# Altium project Coral_Dev_Baseboard.PrjPcb (part 2 of 5)

## Sheet 04_HDMI_MIPI.SchDoc
size A2; ApprovedBy: DNP; CheckedBy: DNP; Author: DNP; CompanyName: Google LLC; DrawnBy: DNP; Engineer: Bangfei/Michael/Leo; Organization: Google LLC; Address1: 1600 Amphitheatre Parkway; Address2: Mountain View, CA 94043; Address3: DNP; Address4: DNP; DocumentNumber: DNP; Revision: PVT; SheetNumber: 4; SheetTotal: 11; VersionControl_RevNumber: DNP; IsUserConfigurable: DNP; Time: DNP; ImagePath: DNP; Rule: DNP; ProjectName: Enterprise; Application_BuildNumber: DNP
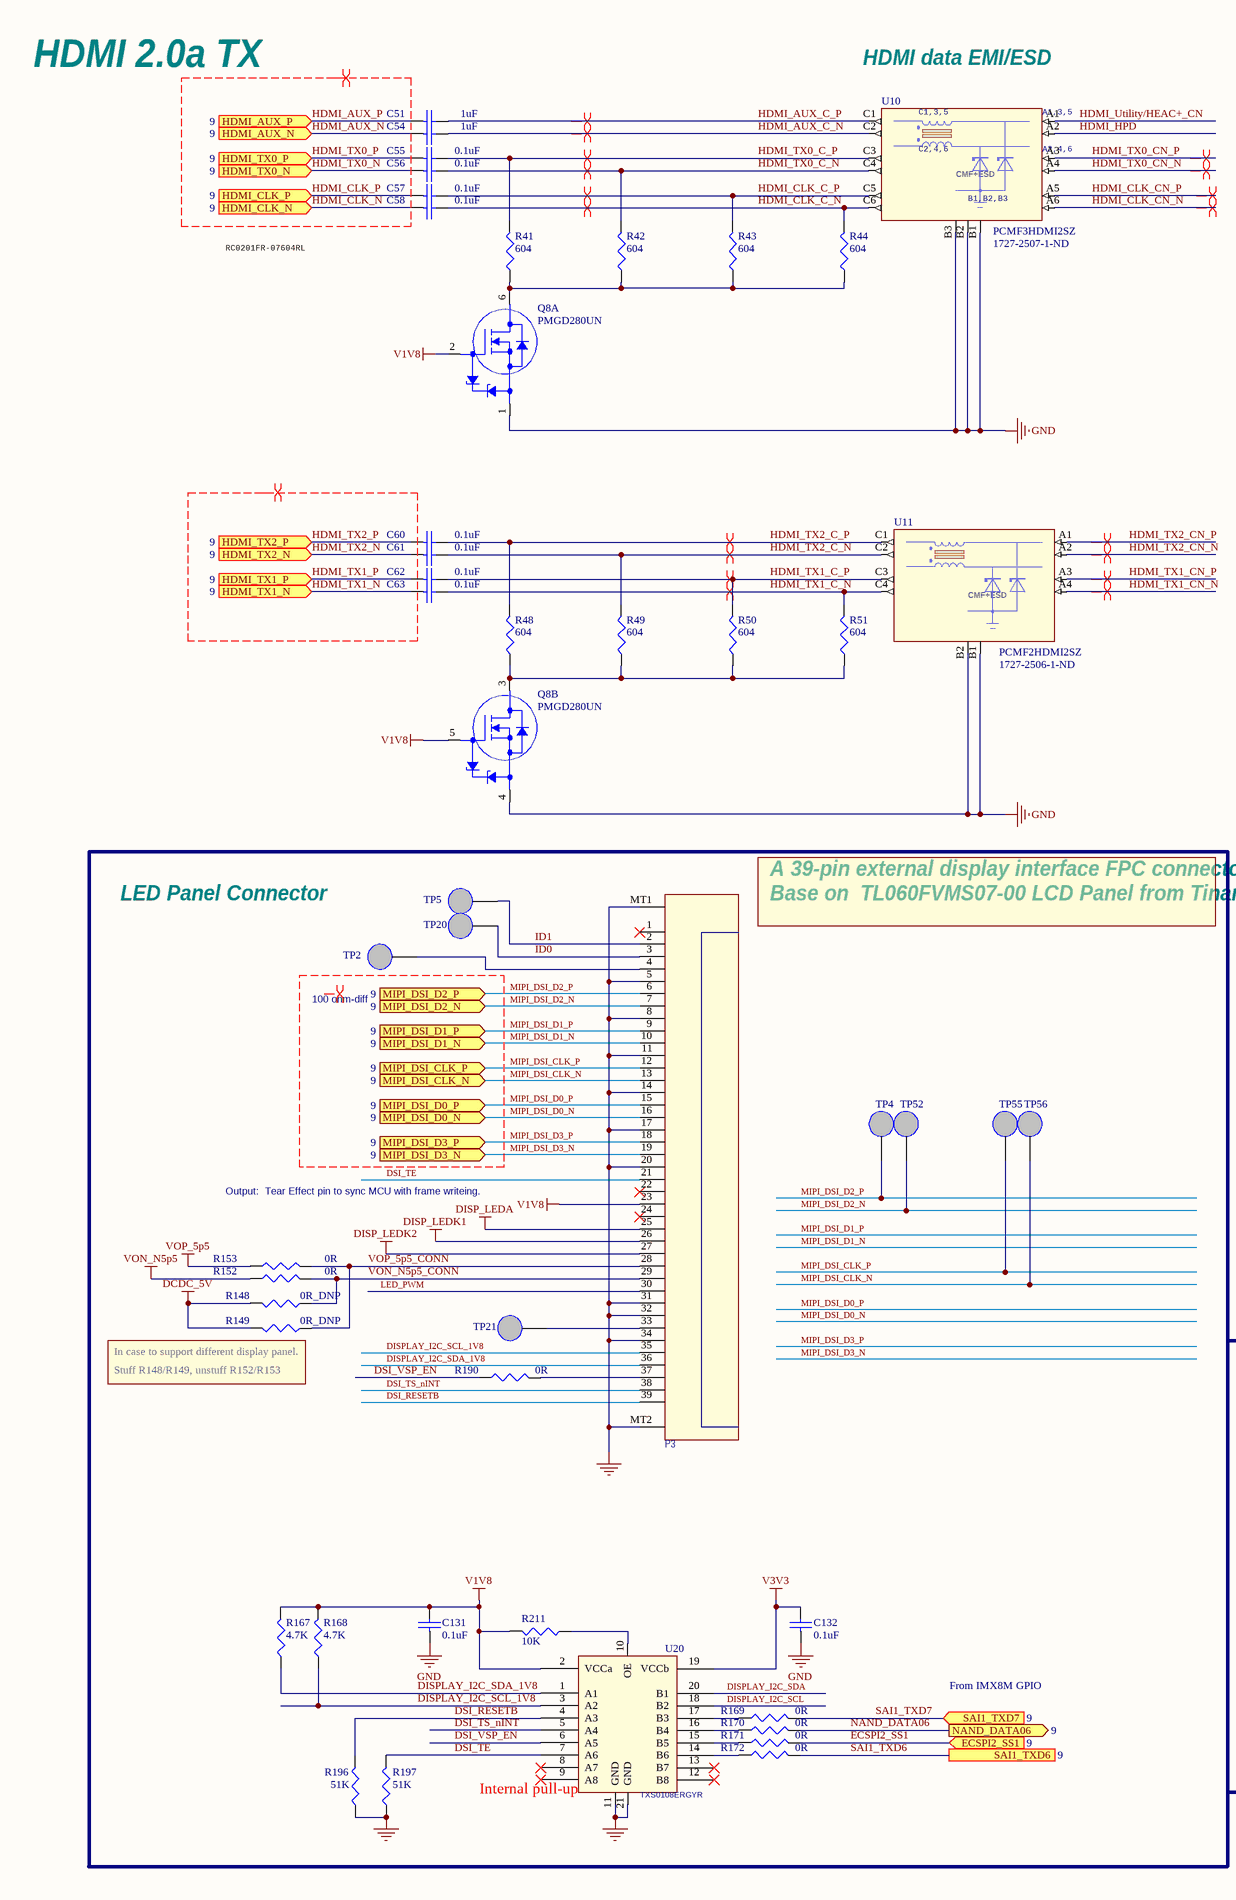
[diagram p4: 04_HDMI_MIPI.SchDoc, left]
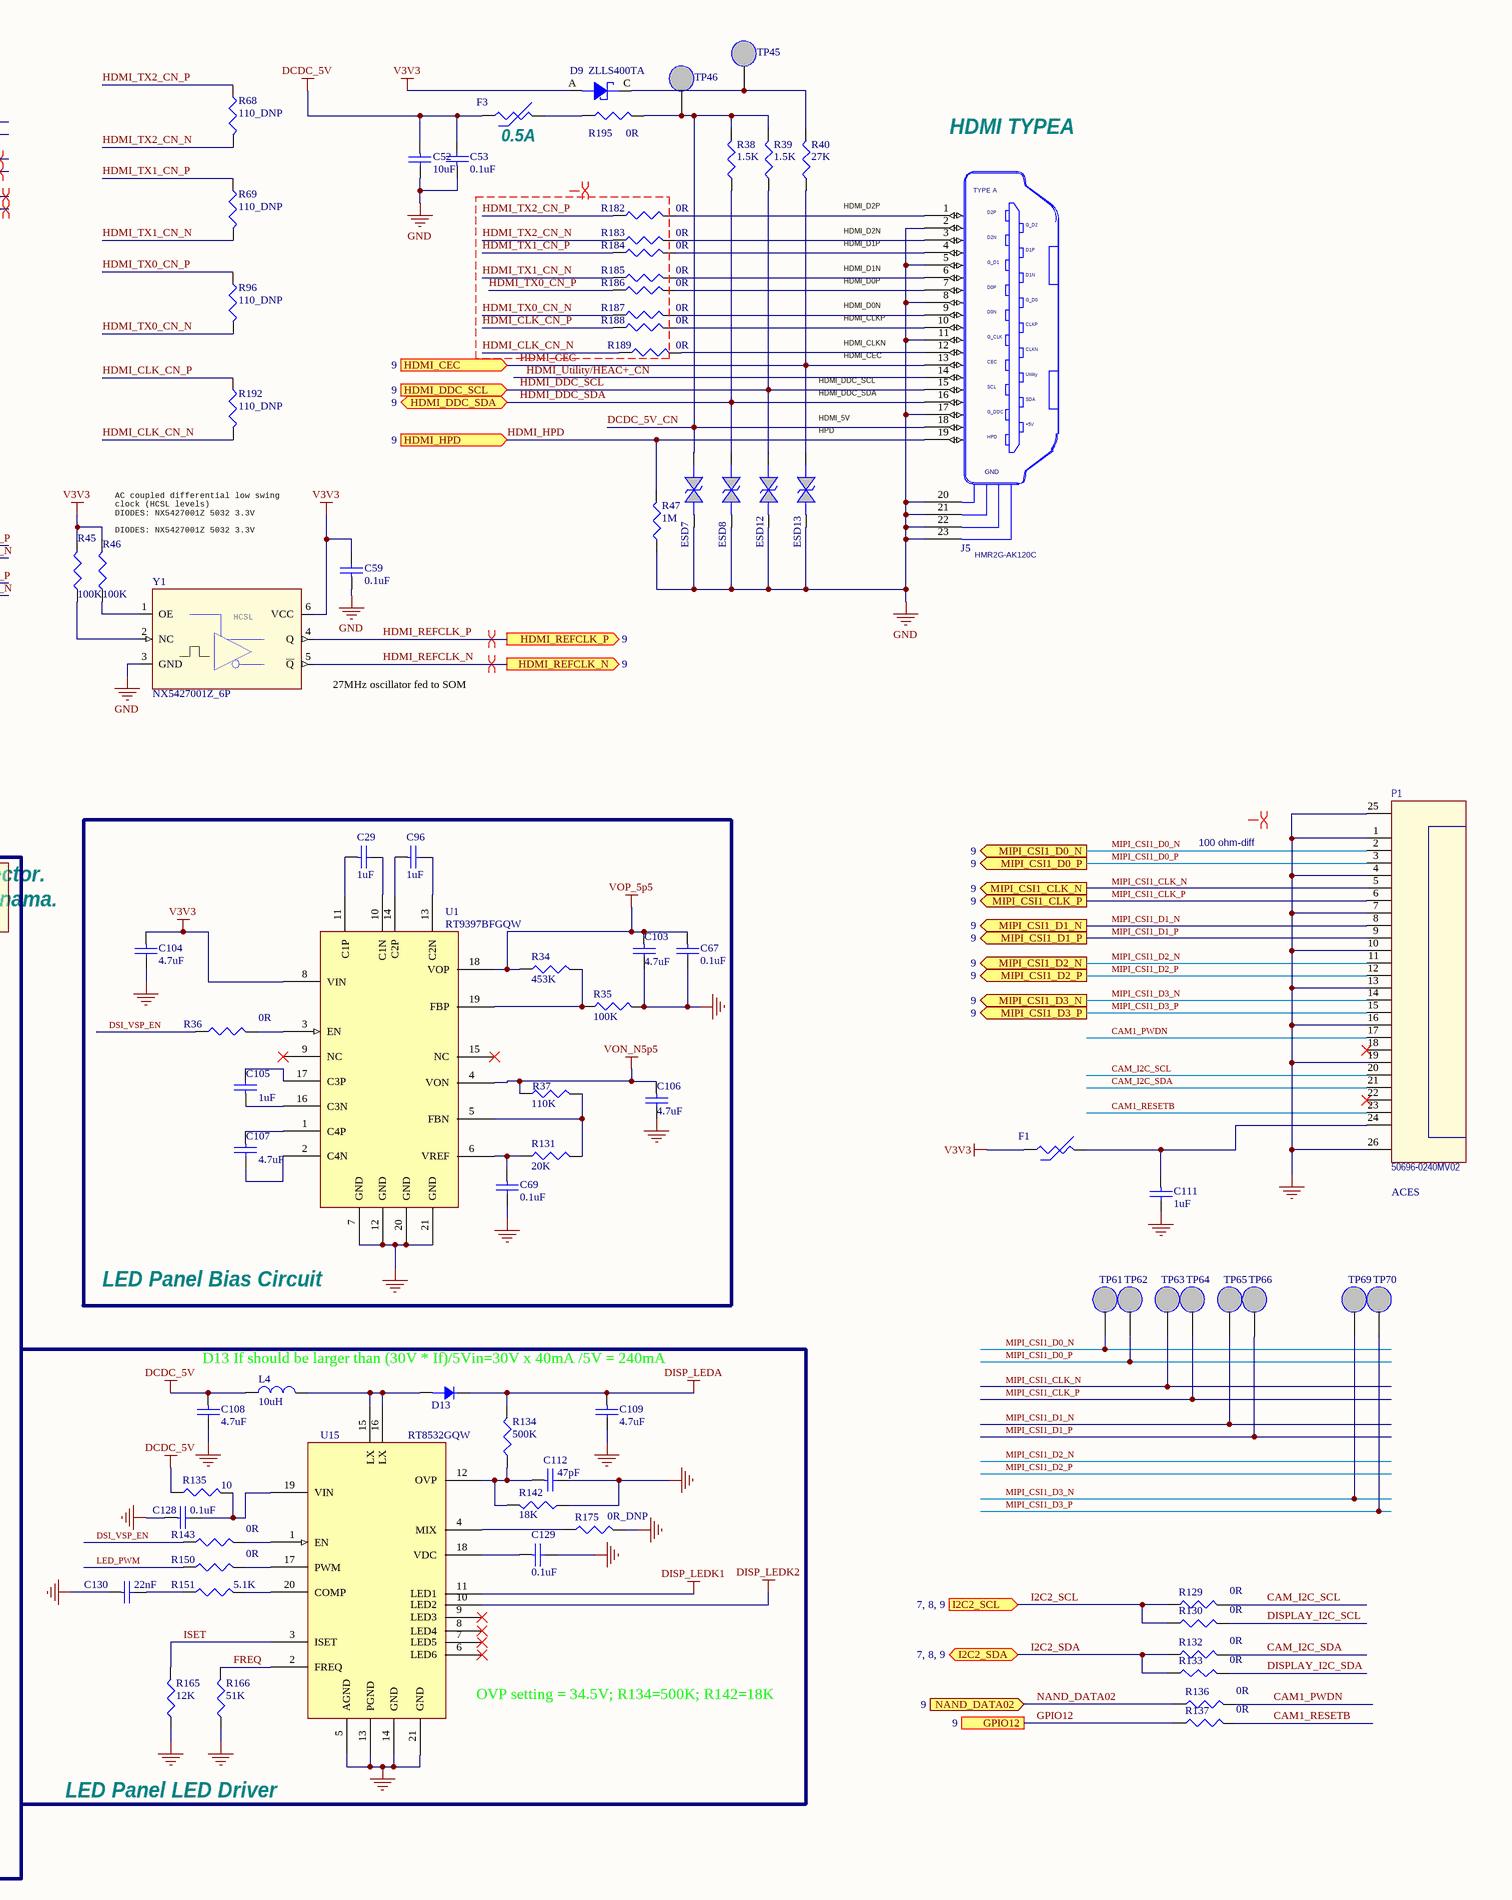
[diagram p5: 04_HDMI_MIPI.SchDoc, right]

### Parts
C29  value 1uF  [0201]  (hidden comment: 1uF/6.3V)
C51  value 1uF  [0402]  (hidden comment: 1uF/25V)
C52  value 10uF  [0402]  (hidden comment: 10uF/10V)
C53  value 0.1uF  [0201]  (hidden comment: 0.1uF/10V)
C54  value 1uF  [0402]  (hidden comment: 1uF/25V)
C55  value 0.1uF  [0201]  (hidden comment: 0.1uF/10V)
C56  value 0.1uF  [0201]  (hidden comment: 0.1uF/10V)
C57  value 0.1uF  [0201]  (hidden comment: 0.1uF/10V)
C58  value 0.1uF  [0201]  (hidden comment: 0.1uF/10V)
C59  value 0.1uF  [0201]  (hidden comment: 0.1uF/10V)
C60  value 0.1uF  [0201]  (hidden comment: 0.1uF/10V)
C61  value 0.1uF  [0201]  (hidden comment: 0.1uF/10V)
C62  value 0.1uF  [0201]  (hidden comment: 0.1uF/10V)
C63  value 0.1uF  [0201]  (hidden comment: 0.1uF/10V)
C67  value 0.1uF  [0201]  (hidden comment: 0.1uF/10V)
C69  value 0.1uF  [0201]  (hidden comment: 0.1uF/10V)
C96  value 1uF  [0201]  (hidden comment: 1uF/6.3V)
C103  value 4.7uF  [0402]  (hidden comment: 4.7uF/10V)
C104  value 4.7uF  [0402]  (hidden comment: 4.7uF/10V)
C105  value 1uF  [0201]  (hidden comment: 1uF/6.3V)
C106  value 4.7uF  [0402]  (hidden comment: 4.7uF/10V)
C107  value 4.7uF  [0402]  (hidden comment: 4.7uF/10V)
C108  value 4.7uF  [0402]  (hidden comment: 4.7uF/10V)
C109  value 4.7uF  [0402]  (hidden comment: 4.7uF/10V)
C111  value 1uF  [0201]  (hidden comment: 1uF/6.3V)
C112  value 47pF  [0201]  (hidden comment: 47pF/25V)
C128  value 0.1uF  [0201]  (hidden comment: 0.1uF/10V)
C129  value 0.1uF  [0201]  (hidden comment: 0.1uF/10V)
C130  value 22nF  [0201]  (hidden comment: 22nF/6.3V)
C131  value 0.1uF  [0201]  (hidden comment: 0.1uF/10V)
C132  value 0.1uF  [0201]  (hidden comment: 0.1uF/10V)
D9  ZLLS400TA  [SOD323]
D13  CUS10F30  [0805-Diode]  (value not drawn)
ESD7  3.5pF/5V  [0201]  (value not drawn)
ESD8  3.5pF/5V  [0201]  (value not drawn)
ESD12  3.5pF/5V  [0201]  (value not drawn)
ESD13  3.5pF/5V  [0201]  (value not drawn)
F1  PTC_FUSE_0805_0p5A  [0805]  (value not drawn)
F3  PTC_FUSE_0805_0p5A  [0805]  (value not drawn)
J5  HMR2G-AK120C  [HDMI19-HMR2G-AK120C]
L4  10uH  [AP3-00115]
P1  50696-0240MV02  QCI Supplier: ACES  [FPC24-0_5-14_18x4_71MM]
P3  FH26-39S-0.3SHW(05)  [FPC39-FH26W-39S-0_3SHW]  (value not drawn)
Q8  PMGD280UN  [SOT-363_0P65_SMT]  (parts A,B of 2)
R34  453K  [0201]
R35  100K  [0201]
R36  0R  [0201]
R37  110K  [0201]
R38  1.5K  [0201]
R39  1.5K  [0201]
R40  27K  [0201]
R41  604  [0201]
R42  604  [0201]
R43  604  [0201]
R44  604  [0201]
R45  100K  [0201]
R46  100K  [0201]
R47  1M  [0201]
R48  604  [0201]
R49  604  [0201]
R50  604  [0201]
R51  604  [0201]
R68  value 110_DNP  [0201]  (hidden comment: 110)
R69  value 110_DNP  [0201]  (hidden comment: 110)
R96  value 110_DNP  [0201]  (hidden comment: 110)
R129  0R  [0201]
R130  0R  [0201]
R131  20K  [0201]
R132  0R  [0201]
R133  0R  [0201]
R134  500K  [0201]
R135  10  [0201]
R136  0R  [0201]
R137  0R  [0201]
R142  18K  [0201]
R143  0R  [0201]
R148  0R_DNP  [0603]
R149  0R_DNP  [0603]
R150  0R  [0201]
R151  5.1K  [0201]
R152  0R  [0603]
R153  0R  [0603]
R165  12K  [0402]
R166  51K  [0201]
R167  4.7K  [0402]
R168  4.7K  [0402]
R169  0R  [0201]
R170  0R  [0201]
R171  0R  [0201]
R172  0R  [0201]
R175  0R_DNP  [0201]
R182  0R  [0201]
R183  0R  [0201]
R184  0R  [0201]
R185  0R  [0201]
R186  0R  [0201]
R187  0R  [0201]
R188  0R  [0201]
R189  0R  [0201]
R190  value 0R  [0201]  (hidden comment: 0R_DNP)
R192  value 110_DNP  [0201]  (hidden comment: 110)
R195  0R  [0603]
R196  51K  [0201]
R197  51K  [0201]
R211  10K  [0201]
TP2  TP NM  [TP_SMD]  (value not drawn)  (no BOM)
TP4  TP NM  [TP2040]  (value not drawn)  (no BOM)
TP5  TP NM  [TP_SMD]  (value not drawn)  (no BOM)
TP20  TP NM  [TP_SMD]  (value not drawn)  (no BOM)
TP21  TP NM  [TP_SMD]  (value not drawn)  (no BOM)
TP45  TP NM  [TP_SMD_L]  (value not drawn)  (no BOM)
TP46  TP NM  [TP_SMD_L]  (value not drawn)  (no BOM)
TP52  TP NM  [TP2040]  (value not drawn)  (no BOM)
TP55  TP NM  [TP2040]  (value not drawn)  (no BOM)
TP56  TP NM  [TP2040]  (value not drawn)  (no BOM)
TP61  TP NM  [TP2040]  (value not drawn)  (no BOM)
TP62  TP NM  [TP2040]  (value not drawn)  (no BOM)
TP63  TP NM  [TP2040]  (value not drawn)  (no BOM)
TP64  TP NM  [TP2040]  (value not drawn)  (no BOM)
TP65  TP NM  [TP2040]  (value not drawn)  (no BOM)
TP66  TP NM  [TP2040]  (value not drawn)  (no BOM)
TP69  TP NM  [TP2040]  (value not drawn)  (no BOM)
TP70  TP NM  [TP2040]  (value not drawn)  (no BOM)
U1  RT9397BFGQW  [WQFN20-0_4-3_1x3_1-H0_8MM-1]
U10  PCMF3HDMI2SZ  Supplier Part Number 1: 1727-2507-1-ND  [WLCSP15_0P4_2P42X1P22_SMDP]
U11  PCMF2HDMI2SZ  Supplier Part Number 1: 1727-2506-1-ND  [WLCSP10_0P4_1P2X1P6MM_SMDP]
U15  RT8532GQW  [WQFN20-0_4-3_1x3_1-H0_8MM-2]
U20  TXS0108ERGYR  [VQFN20-0_5-4_65X3_65MM-H1MM]
Y1  NX5427001Z_6P  [OSC6_1P27_5P2X3P4]

### Blocks framed on the sheet
LED Panel Bias Circuit: C29 C67 C69 C96 C103-C107 R34-R37 R131 U1
LED Panel LED Driver: C108 C109 C112 C128-C130 D13 L4 R134 R135 R142 R143 R150 R151 R165 R166 R175 U15

### Ports
ECSPI2_SS1 (in, see 9), GPIO12 (see 9), HDMI_AUX_N (in, see 9), HDMI_AUX_P (in, see 9), HDMI_CEC (in, see 9), HDMI_CLK_N (in, see 9), HDMI_CLK_P (in, see 9), HDMI_DDC_SCL (in, see 9), HDMI_DDC_SDA (bidir, see 9), HDMI_HPD (in, see 9), HDMI_REFCLK_N (out, see 9), HDMI_REFCLK_P (out, see 9), HDMI_TX0_N (in, see 9), HDMI_TX0_P (in, see 9), HDMI_TX1_N (in, see 9), HDMI_TX1_P (in, see 9), HDMI_TX2_N (in, see 9), HDMI_TX2_P (in, see 9), I2C2_SCL (in, see 7, 8, 9), I2C2_SDA (bidir, see 7, 8, 9), MIPI_CSI1_CLK_N (out, see 9), MIPI_CSI1_CLK_P (out, see 9), MIPI_CSI1_D0_N (out, see 9), MIPI_CSI1_D0_P (out, see 9), MIPI_CSI1_D1_N (out, see 9), MIPI_CSI1_D1_P (out, see 9), MIPI_CSI1_D2_N (out, see 9), MIPI_CSI1_D2_P (out, see 9), MIPI_CSI1_D3_N (out, see 9), MIPI_CSI1_D3_P (out, see 9), MIPI_DSI_CLK_N (in, see 9), MIPI_DSI_CLK_P (in, see 9), MIPI_DSI_D0_N (in, see 9), MIPI_DSI_D0_P (in, see 9), MIPI_DSI_D1_N (in, see 9), MIPI_DSI_D1_P (in, see 9), MIPI_DSI_D2_N (in, see 9), MIPI_DSI_D2_P (in, see 9), MIPI_DSI_D3_N (in, see 9), MIPI_DSI_D3_P (in, see 9), NAND_DATA02 (in, see 9), NAND_DATA06 (out, see 9), SAI1_TXD6 (see 9), SAI1_TXD7 (in, see 9)

### Nets
DCDC_5V: C52.1 C53.2 C108.1 F3.1 L4.1 R135.1 R148.2 R149.2
DISP_LEDA: C109.1 D13.K P3.25 R134.2
DISP_LEDK1: P3.26 U15.11(LED1)
DISP_LEDK2: P3.27 U15.10(LED2)
GND: C52.2 C53.1 C59.1 C67.2 C69.2 C103.2 C104.2 C106.2 C108.2 C109.2 C111.2 C112.2 C128.1 C129.2 C130.1 C131.1 C132.1 ESD7.1 ESD8.1 ESD12.1 ESD13.1 J5.2(D2GND) J5.5(D1GND) J5.8(D0GND) J5.11(CKGND) J5.17(DDCGND) J5.20(GND1) J5.21(GND2) J5.22(GND3) J5.23(GND4) P1.1 P1.4 P1.7 P1.10 P1.13 P1.16 P1.19 P1.25 P1.26 P3.5 P3.8 P3.11 P3.14 P3.17 P3.20 P3.31 P3.32 P3.34 P3.MT1 P3.MT2 Q8.1(S1) Q8.4(S2) R35.2 R47.1 R142.1 R165.1 R166.1 R175.2 R196.1 R197.1 U1.7(GND) U1.12(GND) U1.20(GND) U1.21(GND) U10.B1(GND_CH1) U10.B2(GND_CH2) U10.B3(GND_CH3) U11.B1(GND_CH1) U11.B2(GND_CH2) U15.5(AGND) U15.13(PGND) U15.14(GND) U15.21(GND) U20.11(GND) U20.21(GND) Y1.3(GND)
V1V8: C131.2 P3.23 Q8.2(G1) Q8.5(G2) R167.2 R168.2 R211.2 U20.2(VCCa)  [project net BB_1V8]
V3V3: C59.2 C104.1 C132.2 D9.A F1.1 R45.2 R46.2 U1.8(VIN) U20.19(VCCb) Y1.6(VCC)  [project net BB_3V3]
VON_N5p5: C106.1 R37.1 R152.1 U1.4(VON)
VOP_5p5: C67.1 C103.1 R34.1 R153.1 U1.18(VOP)
CAM1_PWDN: P1.17 R136.2
CAM1_RESETB: P1.23 R137.2
CAM_I2C_SCL: P1.20 R129.2
CAM_I2C_SDA: P1.21 R132.2
DCDC_5V_CN: ESD7.2 J5.18(+5V) R38.2 R39.2 R195.2 TP46.1
DISPLAY_I2C_SCL: R130.2 U20.18(B2)
DISPLAY_I2C_SCL_1V8: P3.35 R168.1 U20.3(A2)
DISPLAY_I2C_SDA: R133.2 U20.20(B1)
DISPLAY_I2C_SDA_1V8: P3.36 R167.1 U20.1(A1)
DSI_RESETB: P3.39 R196.2 U20.4(A3)
DSI_TE: P3.21 R197.2 U20.7(A6)
DSI_TS_nINT: P3.38 U20.5(A4)
DSI_VSP_EN: R36.1 R143.1 R190.1 U20.6(A5)
ECSPI2_SS1: R171.2 ; port ECSPI2_SS1
FREQ: R166.2 U15.2(FREQ)
GPIO12: R137.1 ; port GPIO12
HDMI_AUX_C_N: C54.2 U10.C2(CH1_OUT-)
HDMI_AUX_C_P: C51.2 U10.C1(CH1_OUT+)
HDMI_AUX_N: C54.1 ; port HDMI_AUX_N
HDMI_AUX_P: C51.1 ; port HDMI_AUX_P
HDMI_CEC: ESD13.2 J5.13(CEC) R40.1 ; port HDMI_CEC
HDMI_CLK_C_N: C58.2 R44.2 U10.C6(CH3_OUT-)
HDMI_CLK_C_P: C57.2 R43.2 U10.C5(CH3_OUT+)
HDMI_CLK_CN_N: R189.1 R192.2 U10.A6(CH3_IN-)
HDMI_CLK_CN_P: R188.1 R192.1 U10.A5(CH3_IN+)
HDMI_CLK_N: C58.1 ; port HDMI_CLK_N
HDMI_CLK_P: C57.1 ; port HDMI_CLK_P
HDMI_DDC_SCL: ESD12.2 J5.15(SCL) R39.1 ; port HDMI_DDC_SCL
HDMI_DDC_SDA: ESD8.2 J5.16(SDA) R38.1 ; port HDMI_DDC_SDA
HDMI_HPD: J5.19(HPD) R47.2 U10.A2(CH1_IN-) ; port HDMI_HPD
HDMI_REFCLK_N: Y1.5(~{Q}) ; port HDMI_REFCLK_N
HDMI_REFCLK_P: Y1.4(Q) ; port HDMI_REFCLK_P
HDMI_TX0_C_N: C56.2 R42.2 U10.C4(CH2_OUT-)
HDMI_TX0_C_P: C55.2 R41.2 U10.C3(CH2_OUT+)
HDMI_TX0_CN_N: R96.2 R187.1 U10.A4(CH2_IN-)
HDMI_TX0_CN_P: R96.1 R186.1 U10.A3(CH2_IN+)
HDMI_TX0_N: C56.1 ; port HDMI_TX0_N
HDMI_TX0_P: C55.1 ; port HDMI_TX0_P
HDMI_TX1_C_N: C63.2 R51.2 U11.C4(CH2_OUT-)
HDMI_TX1_C_P: C62.2 R50.2 U11.C3(CH2_OUT+)
HDMI_TX1_CN_N: R69.2 R185.1 U11.A4(CH2_IN-)
HDMI_TX1_CN_P: R69.1 R184.1 U11.A3(CH2_IN+)
HDMI_TX1_N: C63.1 ; port HDMI_TX1_N
HDMI_TX1_P: C62.1 ; port HDMI_TX1_P
HDMI_TX2_C_N: C61.2 R49.2 U11.C2(CH1_OUT-)
HDMI_TX2_C_P: C60.2 R48.2 U11.C1(CH1_OUT+)
HDMI_TX2_CN_N: R68.2 R183.1 U11.A2(CH1_IN-)
HDMI_TX2_CN_P: R68.1 R182.1 U11.A1(CH1_IN+)
HDMI_TX2_N: C61.1 ; port HDMI_TX2_N
HDMI_TX2_P: C60.1 ; port HDMI_TX2_P
HDMI_Utility/HEAC+_CN: J5.14(Utility) U10.A1(CH1_IN+)
I2C2_SCL: R129.1 R130.1 ; port I2C2_SCL
I2C2_SDA: R132.1 R133.1 ; port I2C2_SDA
ID0: P3.3 TP20.1
ID1: P3.2 TP5.1
ISET: R165.2 U15.3(ISET)
LED_PWM: P3.30 R150.1
MIPI_CSI1_CLK_N: P1.5 TP63.1 ; port MIPI_CSI1_CLK_N
MIPI_CSI1_CLK_P: P1.6 TP64.1 ; port MIPI_CSI1_CLK_P
MIPI_CSI1_D0_N: P1.2 TP61.1 ; port MIPI_CSI1_D0_N
MIPI_CSI1_D0_P: P1.3 TP62.1 ; port MIPI_CSI1_D0_P
MIPI_CSI1_D1_N: P1.8 TP65.1 ; port MIPI_CSI1_D1_N
MIPI_CSI1_D1_P: P1.9 TP66.1 ; port MIPI_CSI1_D1_P
MIPI_CSI1_D2_N: P1.11 ; port MIPI_CSI1_D2_N
MIPI_CSI1_D2_P: P1.12 ; port MIPI_CSI1_D2_P
MIPI_CSI1_D3_N: P1.14 TP69.1 ; port MIPI_CSI1_D3_N
MIPI_CSI1_D3_P: P1.15 TP70.1 ; port MIPI_CSI1_D3_P
MIPI_DSI_CLK_N: P3.13 TP56.1 ; port MIPI_DSI_CLK_N
MIPI_DSI_CLK_P: P3.12 TP55.1 ; port MIPI_DSI_CLK_P
MIPI_DSI_D0_N: P3.16 ; port MIPI_DSI_D0_N
MIPI_DSI_D0_P: P3.15 ; port MIPI_DSI_D0_P
MIPI_DSI_D1_N: P3.10 ; port MIPI_DSI_D1_N
MIPI_DSI_D1_P: P3.9 ; port MIPI_DSI_D1_P
MIPI_DSI_D2_N: P3.7 TP52.1 ; port MIPI_DSI_D2_N
MIPI_DSI_D2_P: P3.6 TP4.1 ; port MIPI_DSI_D2_P
MIPI_DSI_D3_N: P3.19 ; port MIPI_DSI_D3_N
MIPI_DSI_D3_P: P3.18 ; port MIPI_DSI_D3_P
NAND_DATA02: R136.1 ; port NAND_DATA02
NAND_DATA06: R170.2 ; port NAND_DATA06
SAI1_TXD6: R172.2 ; port SAI1_TXD6
SAI1_TXD7: R169.2 ; port SAI1_TXD7
VON_N5p5_CONN: P3.29 R148.1 R152.2
VOP_5p5_CONN: P3.28 R149.1 R153.2
NetC29_1: C29.1 U1.11(C1P)
NetC29_2: C29.2 U1.10(C1N)
NetC69_1: C69.1 R131.1 U1.6(VREF)
NetC96_1: C96.1 U1.14(C2P)
NetC96_2: C96.2 U1.13(C2N)
NetC105_1: C105.1 U1.16(C3N)
NetC105_2: C105.2 U1.17(C3P)
NetC107_1: C107.1 U1.1(C4P)
NetC107_2: C107.2 U1.2(C4N)
NetC111_1: C111.1 F1.2 P1.24
NetC112_1: C112.1 R134.1 R142.2 U15.12(OVP)
NetC128_2: C128.2 R135.2 U15.19(VIN)
NetC129_1: C129.1 U15.18(VDC)
NetC130_2: C130.2 R151.1
NetD9_C: D9.C R40.2 TP45.1
NetD13_A: D13.A L4.2 U15.15(LX) U15.16(LX)
NetF3_2: F3.2 R195.1
NetJ5_1: J5.1(D2+) R182.2
NetJ5_3: J5.3(D2-) R183.2
NetJ5_4: J5.4(D1+) R184.2
NetJ5_6: J5.6(D1-) R185.2
NetJ5_7: J5.7(D0+) R186.2
NetJ5_9: J5.9(D0-) R187.2
NetJ5_10: J5.10(CK+) R188.2
NetJ5_12: J5.12(CK-) R189.2
NetP3_4: P3.4 TP2.1
NetP3_33: P3.33 TP21.1
NetP3_37: P3.37 R190.2
NetQ8_3: Q8.3(D2) R48.1 R49.1 R50.1 R51.1
NetQ8_6: Q8.6(D1) R41.1 R42.1 R43.1 R44.1
NetR34_2: R34.2 R35.1 U1.19(FBP)
NetR36_2: R36.2 U1.3(EN)
NetR37_2: R37.2 R131.2 U1.5(FBN)
NetR45_1: R45.1 Y1.2(NC)
NetR46_1: R46.1 Y1.1(OE)
NetR143_2: R143.2 U15.1(EN)
NetR150_2: R150.2 U15.17(PWM)
NetR151_2: R151.2 U15.20(COMP)
NetR169_1: R169.1 U20.17(B3)
NetR170_1: R170.1 U20.16(B4)
NetR171_1: R171.1 U20.15(B5)
NetR172_1: R172.1 U20.14(B6)
NetR175_1: R175.1 U15.4(MIX)
NetR211_1: R211.1 U20.10(OE)

Not connected (* = marked no-connect by the designer): P1 18* 22*; P3 1* 22* 24*; U1 9(NC)* 15(NC)*; U15 6(LED6)* 7(LED5)* 8(LED4)* 9(LED3)*; U20 8(A7)* 9(A8)* 12(B8)* 13(B7)*

### Layout directives
differential pair: (no net found under the mark), HDMI_AUX_C_N, HDMI_AUX_C_P, HDMI_AUX_N, HDMI_AUX_P, HDMI_CLK_C_N, HDMI_CLK_C_P, HDMI_CLK_CN_N, HDMI_CLK_CN_P, HDMI_CLK_N, HDMI_CLK_P, HDMI_REFCLK_N, HDMI_REFCLK_P, HDMI_TX0_C_N, HDMI_TX0_C_P, HDMI_TX0_CN_N, HDMI_TX0_CN_P, HDMI_TX0_N, HDMI_TX0_P, HDMI_TX1_C_N, HDMI_TX1_C_P, HDMI_TX1_CN_N, HDMI_TX1_CN_P, HDMI_TX1_N, HDMI_TX1_P, HDMI_TX2_C_N, HDMI_TX2_C_P, HDMI_TX2_CN_N, HDMI_TX2_CN_P, HDMI_TX2_N, HDMI_TX2_P

### Notes on the sheet
- HDMI 2.0a TX
- HDMI data EMI/ESD
- (near F3) 0.5A
- HDMI TYPEA
- (near R40) HDMI_D2P
- HDMI_D2N
- RC0201FR-07604RL
- HDMI_D1P
- HDMI_D1N
- HDMI_D0P
- HDMI_D0N
- HDMI_CLKP
- HDMI_CLKN
- HDMI_CEC
- HDMI_DDC_SCL
- HDMI_DDC_SDA
- HDMI_5V
- (near ESD13) HPD
- (near R46) DIODES: NX5427001Z 5032 3.3V
- AC coupled differential low swing
  clock (HCSL levels)
  DIODES: NX5427001Z 5032 3.3V
- (near Y1) 27MHz oscillator fed to SOM
- 100 ohm-diff
- LED Panel Connector
- A 39-pin external display interface FPC connector.
- Base on  TL060FVMS07-00 LCD Panel from Tinama.
- (near TP2) 100 ohm-diff
- Output:  Tear Effect pin to sync MCU with frame writeing.
- (near R149) In case to support different display panel.
- (near R149) Stuff R148/R149, unstuff R152/R153
- D13 If should be larger than (30V * If)/5Vin=30V x 40mA /5V = 240mA
- From IMX8M GPIO
- (near U15) OVP setting = 34.5V; R134=500K; R142=18K
- (near U20) Internal pull-up
- Project:
- Engineer:
- Date:
- File:
- Revision:
- Sheet
- of
- (in symbol CONN_HDMI_TYPEA_ACON_HMR2G-AK120C) TYPE A; D2P; G_D2; D2N; D1P; G_D1; D1N; D0P; G_D0; D0N; CLKP; G_CLK; CLKN; G_DDC; GND
- (in symbol NX5427001Z_6P) HCSL
- (in symbol PCMF2HDMI2SZ) CMF+ESD
- (in symbol PCMF3HDMI2SZ) C1,3,5; A1,3,5; C2,4,6; A2,4,6; CMF+ESD; B1,B2,B3

### Library data of the parts
C29 C96 C105 = CAP_0201_1.0uF: CAP CER 1UF 6.3V 20% X5R 0201; MPN: C0603X5R0J105M030BC; QCI MPN: GRM033R60J105M; QPN: CH5101M9E02; QPN Description: CAP CHIP 1UF 6.3V(+-20%,X5R,0201); Function Code: LCD; Supplier 1: Digi-Key; Supplier Part Number 1: 445-8008-1-ND; QCI Supplier: MUR
C51 C54 = CAP_0402_1.0uF_25V: CAP CER 1.0UF 25V 10% X5R 0402; MPN: TMK105BJ105MV-F; QCI MPN: GRM155R61E105K; QPN: CH5104K9B01; QPN Description: CAP CHIP 1UF 25V(+-10%,X5R,0402); Function Code: HMI; Supplier 1: Digi-Key; Supplier Part Number 1: 587-3245-1-ND; QCI Supplier: MUR
C52 = CAP_0402_10uF: CAP CER 10UF 10V 20% X5R 0402; MPN: CL05A106MP5NUNC; QCI MPN: GRM155R61A106M; QPN: CH6102M9B00; QPN Description: CAP CHIP 10U 10V (+-20%, X5R, 0402)'; Function Code: HMI; Supplier 1: Digi-Key; Supplier Part Number 1: 1276-1450-1-ND; QCI Supplier: MUR
C53 C55-C58 C60-C63 = CAP_0201_0.1uF: CAP CER 0.1UF 10V 10% X5R 0201; MPN: C0603X5R1A104K030BC; QCI MPN: GRM033R61A104K; QPN: CH4102K9E00; QPN Description: CAP CHIP 0.1U 10V(+-10%,X5R,0201); Function Code: HMI; Supplier 1: Digi-Key; Supplier Part Number 1: 445-7318-1-ND; QCI Supplier: MUR
C59 = CAP_0201_0.1uF: CAP CER 0.1UF 10V 10% X5R 0201; MPN: C0603X5R1A104K030BC; QCI MPN: GRM033R61A104K; QPN: CH4102K9E00; QPN Description: CAP CHIP 0.1U 10V(+-10%,X5R,0201); Function Code: SOC; Supplier 1: Digi-Key; Supplier Part Number 1: 445-7318-1-ND; QCI Supplier: MUR
C67 C69 C128 C129 C131 C132 = CAP_0201_0.1uF: CAP CER 0.1UF 10V 10% X5R 0201; MPN: C0603X5R1A104K030BC; QCI MPN: GRM033R61A104K; QPN: CH4102K9E00; QPN Description: CAP CHIP 0.1U 10V(+-10%,X5R,0201); Function Code: LCD; Supplier 1: Digi-Key; Supplier Part Number 1: 445-7318-1-ND; QCI Supplier: MUR
C103 C104 C106-C109 = CAP_0402_4.7uF: CAP CER 4.7UF 10V 20% X5R 0402; MPN: C1005X5R1A475M050BC; QCI MPN: GRM155R61A475M; QPN: CH5472M9B01; QPN Description: CAP CHIP 4.7U 10V(+-20%,X5R,0402); Function Code: LCD; Supplier 1: Digi-Key; Supplier Part Number 1: 445-8023-1-ND; QCI Supplier: MUR
C111 = CAP_0201_1.0uF: CAP CER 1UF 6.3V 20% X5R 0201; MPN: C0603X5R0J105M030BC; QCI MPN: GRM033R60J105M; QPN: CH5101M9E02; QPN Description: CAP CHIP 1UF 6.3V(+-20%,X5R,0201); Function Code: CAM; Supplier 1: Digi-Key; Supplier Part Number 1: 445-8008-1-ND; QCI Supplier: MUR
C112 = CAP_0201_47pF: CAP CER 47PF 25V 0201; MPN: GRM0335C1E470FA01D; QCI MPN: GRM0335C1E470J; QPN: CH0474J0E09; QPN Description: CAP CHIP 47P 25V(+-5%,COG,0201); Function Code: LCD; Supplier 1: Digi-Key; Supplier Part Number 1: 490-11298-1-ND; QCI Supplier: MUR
C130 = CAP_0201_22nF: CAP CER 0.022UF 6.3V 10% X5R 0201; MPN: CC0201KRX5R5BB223; QCI MPN: GRM033R60J223K; QPN: CH3221K9E00; QPN Description: CAP CHIP 0.022U 6.3V(+-10%,X5R,0201); Function Code: LCD; Supplier 1: Digi-Key; Supplier Part Number 1: 311-1380-1-ND; QCI Supplier: MUR
D9 = DIODE_SCHTKY: DIODE SCHOTTKY 40V 520MA SOD323; Function Code: HMI; QPN: BCS400TA000; QPN Description: DIODE SCHOTTKY ZLLS400TA(20V,1A); Supplier 1: Digi-Key; Supplier Part Number 1: ZLLS400TACT-ND; QCI Supplier: DDS; MPN: ZLLS400TA; QCI MPN: ZLLS400TA
D13 = Diode_Schottky_0805: DIODE SCHOTTKY 20V 1A 0805; Function Code: LCD; QPN: BC0CUS10000; QPN Description: DIODE SMD SCHOTTKY  CUS10F30(30V,1A); Supplier 1: Digi-Key; Supplier Part Number 1: 478-7800-1-ND; QCI Supplier: TOS; MPN: CUS10F30; QCI MPN: CUS10F30
ESD7 ESD8 ESD12 ESD13 = DIODE BI-DIR TRIG: DIODE TVS 15kV 10V 50A 8pF SMT RoHS; MPN: DESD5V0V1BCSP-7; QPN: BC5V0V1BZ02; QPN Description: DIODE ESD SMD DESD5V0V1BCSP-7 6V,DSN0603; Function Code: HMI; QCI MPN: DESD5V0V1BCSP-7; QCI Supplier: DDS
F1 = PTC_FUSE_0805_0p5A: PTC FUSE 0.5A 0805; QCI MPN: SMD0805P050TF; QPN: DK050TPU004; QPN Description: FUSE SMD 0.5A 6V POLY(SMD0805P050TF); Function Code: CAM; Supplier 1: Digi-Key; Supplier Part Number 1: 507-1813-1-ND; MPN: PTC_FUSE_0805_0p5A; QCI Supplier: PYS
F3 = PTC_FUSE_0805_0p5A: PTC FUSE 0.5A 0805; QCI MPN: SMD0805P050TF; QPN: DK050TPU004; QPN Description: FUSE SMD 0.5A 6V POLY(SMD0805P050TF); Function Code: HMI; Supplier 1: Digi-Key; Supplier Part Number 1: 507-1813-1-ND; MPN: PTC_FUSE_0805_0p5A; QCI Supplier: PYS
J5 = CONN_HDMI_TYPEA_ACON_HMR2G-AK120C: CONN RCPT 19POS HDMI DIP WO FLANGE; Function Code: HMI; QPN: DFHD19MR637; QPN Description: CONN DIP HDMI 19P 2R MR(P0.5,H5.55); MPN: HMR2G-AK120C; QCI MPN: HMR2G-AK120C; QCI Supplier: ACN
L4 = INDUCTOR_LQH3NPN100MJ0: FIXED IND 10UH 710MA 300 MOHM; MPN: LQH3NPN100MJRL; Function Code: LCD; QPN: CV01009MN01; QPN Description: IND CHIP 10UH 0.81A +-20% LQH3NPN100MJRL; Supplier 1: Digi-Key; Supplier Part Number 1: 490-5348-1-ND; Value: 10uH; QCI MPN: LQH3NPN100MJRL; QCI Supplier: MUR
P1 = CONN_ACES_50696-0240MV02: Connector,FP, .5mm pitch, 24-pin, R/A,  SMT; QCI MPN: 50696-0240M-V02; Function Code: CAM; QPN: DFFC24FR095; QPN Description: CONN SMD FPC 24P 1R FR(P0.5,H1.0); Value: 50696-0240MV02; MPN: 50696-0240MV02
P3 = CONN_FH26-39S-0.3SHW(0.5): Connector,FP, .30mm pitch, 39-pin, R/A,  SMT; QPN: DFFC39FR004; QPN Description: CONN SMD FPC 39P 2R FR(P0.6,H0.1); Function Code: LCD; Value: FH26-39S-0.3SHW(05); Supplier 1: Digi-Key; Supplier Part Number 1: HFQ339CT-ND; MPN: FH26-39S-0.3SHW(05); QCI MPN: FH26-39S-0.3SHW(05); QCI Supplier: HRS
Q8 = TRAN_DUAL_NMOS_BSS138: TRANS MOSFET (20V,0.87A,0.4W) SOT363; QPN: BC5V0V1BZ02; QPN Description: DIODE ESD SMD DESD5V0V1BCSP-7 6V,DSN0603; Function Code: HMI; Supplier 1: Digi-Key; Supplier Part Number 1: DMN3190LDW-7DICT-ND; MPN: PMGD280UN; QCI MPN: PMGD280UN; QCI Supplier: NXP
R34 = R_0201_453K: RES SMD 453K OHM JUMPER 1/20W  0201; MPN: ERJ-1GEF4533C; QCI MPN: RM02FTN4533; QPN: CS44531FE00; QPN Description: RES CHIP 453K 1/20W +-1%(0201); Function Code: LCD; Supplier 1: Digi-Key; VALUE: 453K; Supplier Part Number 1: P453KABCT-ND; QCI Supplier: YGO
R35 = R_0201_100K: RES SMD 100K OHM JUMPER 1/20W  0201; MPN: ERJ-1GEF1003C; QCI MPN: RC0201FR-07100KL; QPN: TS41001FE04; QPN Description: RES CHIP 100K 1/20W +-1%(0201)EMS-SEL; Function Code: LCD; Supplier 1: Digi-Key; VALUE: 100K; Supplier Part Number 1: P100KABCT-ND; QCI Supplier: YGO
R36 R143 R150 R169-R172 = R_0201_0: RES SMD 0.0OHM JUMPER 1/20W 0201; MPN: ERJ-1GN0R00C; QCI MPN: RC0201JR-130RL; QPN: CS00001JE18; QPN Description: RES CHIP 0(1/20W,+-5%,0201); Function Code: LCD; Supplier 1: Digi-Key; Supplier Part Number 1: P15979CT-ND; VALUE: 0R; QCI Supplier: YGO
R37 = R_0201_110K: RES SMD 110K OHM  +/-1% 1/20W  0201; MPN: ERJ-1GNF1103C; QCI MPN: RC0201FR-07110KL; QPN: CS41101FE00; QPN Description: RES CHIP 110K 1/20W 1% (0201); Function Code: LCD; Supplier 1: Digi-Key; VALUE: 110K; Supplier Part Number 1: P122415CT-ND; QCI Supplier: YGO
R38 R39 = R_0201_1.5K: RES SMD 1.5K OHM JUMPER 1/20W  0201; MPN: ERJ-1GEJ6152C; QCI MPN: RC0201FR-071K5L; QPN: CS21501FE01; QPN Description: RES CHIP 1.5K 1/20W +-1%(0201); Function Code: HMI; Supplier 1: Digi-Key; VALUE: 1.5K; Supplier Part Number 1: P1.5KAGCT-ND; QCI Supplier: YGO
R40 = R_0201_27K: RES SMD 27K OHM JUMPER 1/20W  0201; MPN: ERJ-1GEF2702C; QCI MPN: RC0201JR-0727KL; QPN: CS32701JE00; QPN Description: RES CHIP 27K 1/20W +-5%(0201); Function Code: HMI; Supplier 1: Digi-Key; VALUE: 27K; Supplier Part Number 1: P27.0KABCT-ND; QCI Supplier: YGO
R41-R44 R48-R51 = R_0201_604: RES SMD 604 OHM JUMPER 1/20W  0201; MPN: ERJ-1GEF6040C; QCI MPN: RC0201FR-07604RL; QPN: CS16041FE01; QPN Description: RES CHIP 604 1/20W +-1%(0201); Function Code: HMI; Supplier 1: Digi-Key; VALUE: 604; Supplier Part Number 1: P604ABCT-ND; QCI Supplier: YGO
R45 R46 = R_0201_100K: RES SMD 100K OHM JUMPER 1/20W  0201; MPN: ERJ-1GEF1003C; QCI MPN: RC0201FR-07100KL; QPN: TS41001FE04; QPN Description: RES CHIP 100K 1/20W +-1%(0201)EMS-SEL; Function Code: SOC; Supplier 1: Digi-Key; VALUE: 100K; Supplier Part Number 1: P100KABCT-ND; QCI Supplier: YGO
R47 = R_0201_1M: RES SMD 1M OHM 1% 1/20W 0201; MPN: ERJ-1GEF1004C; QCI MPN: RC0201FR-071ML; QPN: CS51001FE00; QPN Description: RES CHIP 1M 1/20W +-1%(0201); Function Code: HMI; Supplier 1: Digi-Key; Supplier Part Number 1: P1.00MABCT-ND; VALUE: 1M; QCI Supplier: YGO
R68 R69 R96 R192 = R_0201_110: RES SMD 110 OHM 1% 1/20W 0201; MPN: ERJ-1GEF1100C; QCI MPN: RC0201FR-07110RL; QPN: CS11101FE00; QPN Description: RES CHIP 110 1/20W +-1% (0201); Function Code: DBG; Supplier 1: Digi-Key; Supplier Part Number 1: P110ABCT-ND; QCI Supplier: YGO
R129 R130 R132 R133 R136 R137 = R_0201_0: RES SMD 0.0OHM JUMPER 1/20W 0201; MPN: ERJ-1GN0R00C; QCI MPN: RC0201JR-130RL; QPN: CS00001JE18; QPN Description: RES CHIP 0(1/20W,+-5%,0201); Function Code: CAM; Supplier 1: Digi-Key; Supplier Part Number 1: P15979CT-ND; VALUE: 0R; QCI Supplier: YGO
R131 = R_0201_20K: RES SMD 20K OHM 1% 1/20W 0201; MPN: ERJ-1GEF2002C; QCI MPN: RC0201FR-0720KL; QPN: CS32001FE00; QPN Description: RES CHIP 20K 1/20W +-1%(0201); Function Code: LCD; Supplier 1: Digi-Key; Supplier Part Number 1: P20.0KABCT-ND; VALUE: 20K; QCI Supplier: YGO
R134 = R_0201_499K: RES SMD 499K OHM JUMPER 1/20W  0201; MPN: ERJ-1GEF4993C; QCI MPN: RC0201FR-07499KL; QPN: CS44991FE00; QPN Description: RES CHIP 499K 1/20W +-1%(0201); Function Code: LCD; Supplier 1: Digi-Key; VALUE: 500K; Supplier Part Number 1: P499KABCT-ND; QCI Supplier: YGO
R135 = R_0201_10: RES SMD 10 OHM 1% 1/20W 0201; MPN: ERJ-1GEF10R0C; QCI MPN: RC0201JR-0710RL; QPN: CS01001JE11; QPN Description: RES CHIP 10(1/20W,+-5%,0201); Function Code: LCD; Supplier 1: Digi-Key; VALUE: 10; Supplier Part Number 1: P10.0ABCT-ND; QCI Supplier: YGO
R142 = R_0201_24K: RES SMD 24K OHM 1% 1/20W 0201; MPN: ERJ-1GEF2402C; QCI MPN: RC0201FR-0724KL; QPN: CS31801FE02; QPN Description: RES CHIP 18K 1/20W +-1%(0201)SELASN; Function Code: LCD; Supplier 1: Digi-Key; Supplier Part Number 1: P24.0KABCT-ND; VALUE: 18K; QCI Supplier: YGO
R148 R149 = R_0603_0: RES SMD 0.0 OHM JUMPER 1/4W 0603; MPN: CRCW06030000Z0EAHP; QCI MPN: RC0603FR-070RL; DNP: V; QPN: CS00003F916; QPN Description: RES CHIP 0 1/10W +-1% (0603); Function Code: LCD; Supplier 1: Digi-Key; Supplier Part Number 1: 541-0.0SBDKR-ND; VALUE: 0R_DNP; QCI Supplier: YGO
R151 = R_0201_5.1K: RES SMD 5.1K OHM JUMPER 1/20W  0201; MPN: ERJ-JGEF5101C; QCI MPN: RC0201FR-075K1L; QPN: CS25101FE00; QPN Description: RES CHIP 5.1K 1/20W +-1%(0201); Function Code: LCD; Supplier 1: Digi-Key; Supplier Part Number 1: P5.10KABCT-ND; VALUE: 5.1K; QCI Supplier: YGO
R152 R153 R195 = R_0603_0: RES SMD 0.0 OHM JUMPER 1/4W 0603; MPN: CRCW06030000Z0EAHP; QCI MPN: RC0603FR-070RL; QPN: CS00003F916; QPN Description: RES CHIP 0 1/10W +-1% (0603); Function Code: LCD; Supplier 1: Digi-Key; Supplier Part Number 1: 541-0.0SBDKR-ND; VALUE: 0R; QCI Supplier: YGO
R165 = R_0402_12k: RES SMD 12K OHM 1% 1/10W 0402; MPN: ERJ-2RKF1202X; QCI MPN: RC0402JR-0712K; QPN: CS31202JB09; QPN Description: RES CHIP 12K 1/16W +-5% (0402); Function Code: LCD; Supplier 1: Digi-Key; Supplier Part Number 1: P12.0KLCT-ND; VALUE: 12K; QCI Supplier: YGO
R166 R196 R197 = R_0201_51K: RES SMD 51K OHM 1% 1/20W 0201; MPN: ERJ-1GEF5102C; QCI MPN: RC0201FR-0751KL; QPN Description: RES CHIP 51K(1/20W,+-1%,0201); Function Code: LCD; QPN: CS35101FE01; Supplier 1: Digi-Key; Supplier Part Number 1: P51.0KABCT-ND; VALUE: 51K; QCI Supplier: YGO
R167 R168 = R_0402_4.7k: RES SMD 4.7K OHM 1% 1/10W 0402; MPN: ERJ-2RKF4701X; QCI MPN: RC0402FR-074K7L; QPN: CS24702FB10; QPN Description: RES CHIP 4.7K 1/16W +-1%(0402); Function Code: LCD; Supplier 1: Digi-Key; Supplier Part Number 1: P4.70KLCT-ND; VALUE: 4.7K; QCI Supplier: YGO
R175 = R_0201_0: RES SMD 0.0OHM JUMPER 1/20W 0201; MPN: ERJ-1GN0R00C; QCI MPN: RC0201JR-130RL; DNP: V; QPN: CS00001JE18; QPN Description: RES CHIP 0(1/20W,+-5%,0201); Function Code: LCD; Supplier 1: Digi-Key; Supplier Part Number 1: P15979CT-ND; VALUE: 0R_DNP; QCI Supplier: YGO
R182-R189 = R_0201_0: RES SMD 0.0OHM JUMPER 1/20W 0201; MPN: ERJ-1GN0R00C; QCI MPN: RC0201JR-130RL; QPN: CS00001JE18; QPN Description: RES CHIP 0(1/20W,+-5%,0201); Function Code: HMI; Supplier 1: Digi-Key; Supplier Part Number 1: P15979CT-ND; VALUE: 0R; QCI Supplier: YGO
R190 = R_0201_0: as R14 on sheet 03_USB; Supplier 1: Digi-Key; Supplier Part Number 1: P15979CT-ND; QCI Supplier: YGO
R211 = R_0201_10K: RES SMD 10K OHM JUMPER 1/20W  0201; MPN: ERJ-1GEF103C; QCI MPN: RC0201JR-1310KL; QPN: CS31001JE16; QPN Description: RES CHIP 10K 1/20W +-5%(0201); Function Code: DBG; Supplier 1: Digi-Key; VALUE: 10K; Supplier Part Number 1: P10.0KABCT-ND; QCI Supplier: YGO
TP2 TP5 TP20 TP21 = TP: TEST POIN
TP4 TP45 TP46 TP52 TP55 TP56 TP61-TP66 TP69 TP70 = TP_L: TEST POINT (Large)
U1 = RT9397BF: IC, Charge Pump Controller, WQFN20; Function Code: LCD; QPN: AL009397000; QPN Description: IC CTRL(20P)RT9397BFGQW(WQFN); MPN: RT9397BFGQW; QCI MPN: RT9397BFGQW; QCI Supplier: RTK
U10 = PCMF3HDMI2SZ: Function Code: HMI; QPN: CX3HDMI2000; QPN Description: EMI FILTER PCMF2HDMI3S(3,100NA); Supplier 1: Digi-Key; MPN: PCMF3HDMI2SZ; QCI MPN: PCMF3HDMI2S; QCI Supplier: NXP
U11 = PCMF2HDMI2SZ: Function Code: HMI; QPN: CX2HDMI2000; QPN Description: EMI FILTER PCMF2HDMI2S(2,100NA); Supplier 1: Digi-Key; MPN: PCMF2HDMI2SZ; QCI MPN: PCMF2HDMI2S; QCI Supplier: NXP
U15 = RT8532: IC, 6-string 43V White LED drivers with Boost Regulator, WQFN20; QPN: AL008532000; QPN Description: IC CTRL (20P) RT8532GQW (WQFN-20L 3X3); Function Code: LCD; MPN: RT8532GQW; QCI MPN: RT8532GQW; QCI Supplier: RTK
U20 = TXS0108ERGYR: Voltage Level Translator Bidirectional 1 Circuit 8 Channel 60Mbps 20-VQFN (3.5x4.5); QPN: AL000108001; QPN Description: IC OTHER(20P) TXS0108ERGYR(QFN); Function Code: LCD; Supplier 1: Digi-Key; Supplier Part Number 1: 296-24806-1-ND; MPN: TXS0108ERGYR; QCI MPN: TXS0108ERGYR; QCI Supplier: TIC
Y1 = NX5427001Z_6P: Function Code: SOC; MPN: NX5427001Z_6P